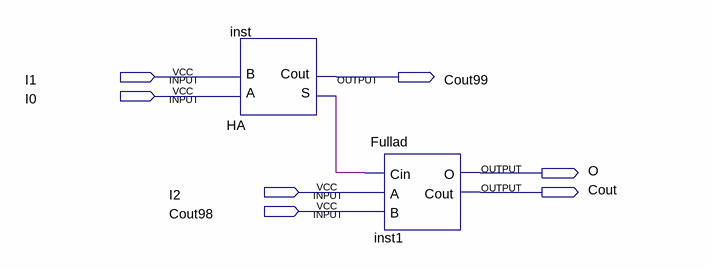
[diagram p0: schematic sheet]
// Quartus schematic B5.bdf as structural Verilog: 2 symbols, 7 pins
module B5 (
  input  I1,
  input  I0,
  input  I2,
  input  Cout98,
  output Cout99,
  output O,
  output Cout
);

  wire inst_s;

  HA inst (.A(I0), .B(I1), .S(inst_s), .Cout(Cout99));
  Fullad inst1 (.Cin(inst_s), .A(I2), .B(Cout98), .O(O), .Cout(Cout));
endmodule
